# EAGLE schematic wordclock_zero (EAGLE 7.5.0)

## Sheet 1 of 2
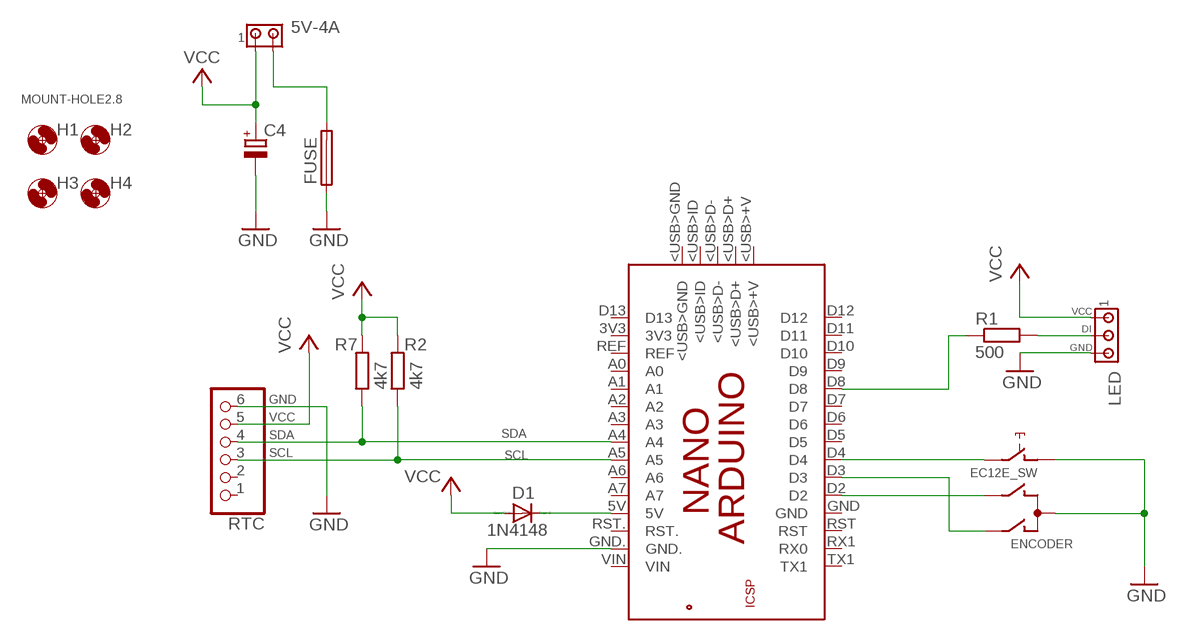
[diagram p0: schematic, sheet 1]

### Parts
5V-4A  5V-4A  MTA02-156  [1X2MTA]
C4  CPOL-EUE5-10.5  [E5-10,5]
D1  1N4148  1N4148DO35-10  [DO35-10]
ENCODER  EC12E_SW  [ALPS_EC12E_SW]
FUSE  FUSELITTLEFUSE  [LITTLEFUSE]
H1  MOUNT-HOLE2.8  [2,8]
H2  MOUNT-HOLE2.8  [2,8]
H3  MOUNT-HOLE2.8  [2,8]
H4  MOUNT-HOLE2.8  [2,8]
LED  MTA03-156  [1X3MTA]
PCB2  ARDUINO_NANO  [ARDUINO_NANO]
R1  500  R-EU_0207/7  [0207/7]
R2  4k7  R-EU_0207/10  [0207/10]
R7  4k7  R-EU_0207/10  [0207/10]
RTC  PINHD-1X6  [1X06]

### Nets
DI: LED.2 R1.2
GND: C4.- ENCODER.C ENCODER.D FUSE.1 LED.3 PCB2.GND. RTC.6
N$1: ENCODER.E PCB2.D4
N$4: PCB2.D8 R1.1
N$5: 5V-4A.2 FUSE.2
N$6: ENCODER.B PCB2.D2
N$7: ENCODER.A PCB2.D3
N$12: D1.C PCB2.5V
SCL: PCB2.A5 R2.1 RTC.3
SDA: PCB2.A4 R7.1 RTC.4
VCC: 5V-4A.1 C4.+ D1.A LED.1 R2.2 R7.2 RTC.5
Unconnected: ENCODER.GND1(G) ENCODER.GND2(G) PCB2.3V3 PCB2.5V. PCB2.<USB>+V PCB2.<USB>D+ PCB2.<USB>D- PCB2.<USB>GND PCB2.<USB>ID PCB2.A0 PCB2.A1 PCB2.A2 PCB2.A3 PCB2.A6 PCB2.A7 PCB2.D5 PCB2.D6 PCB2.D7 PCB2.D9 PCB2.D10 PCB2.D11 PCB2.D12 PCB2.D13 PCB2.GND PCB2.GND_ PCB2.MISO PCB2.MOSI PCB2.REF PCB2.RESET.. PCB2.RST PCB2.RST. PCB2.RX1(RX0) PCB2.SCK PCB2.TX1 PCB2.VIN RTC.1 RTC.2

### Notes on the sheet
- GND
- GND
- VCC
- SDA
- SCL

## Sheet 2 of 2

## Library data of the parts
5V-4A = con-amp:MTA02-156: AMP connector
C4 = rcl:CPOL-EU: POLARIZED CAPACITOR, European symbol
D1 = diode:1N4148: DIODE high speed (Philips)
ENCODER = switch-alps:EC12E_SW: ALPS rotary Encoder EC12E series with switch; MPN: EC12E2424407; OC_FARNELL: 1520813; OC_NEWARK: 74M1068
FUSE = fuse:FUSE: Fuse; OC_FARNELL: unknown; OC_NEWARK: unknown
H1-H4 = holes:MOUNT-HOLE: MOUNTING HOLE with drill center marker
LED = con-amp:MTA03-156: AMP connector
PCB2 = E14_Arduino_revB_2:ARDUINO_NANO: Device for representing an Arduino Nano board with a footprint in an EAGLE design. Created by Dave Young for Element14. More EAGLE documentation at: http://www.element14.com/community/community/knode/cadsoft_eagle
R1 = resistor:R-EU_: RESISTOR, European symbol
R2 R7 = rcl:R-EU_: RESISTOR, European symbol
RTC = PINHD8:90:PINHD-1X6: PIN HEADER